# EAGLE design DAC_OutputStage_4 (EAGLE 9.6.2)
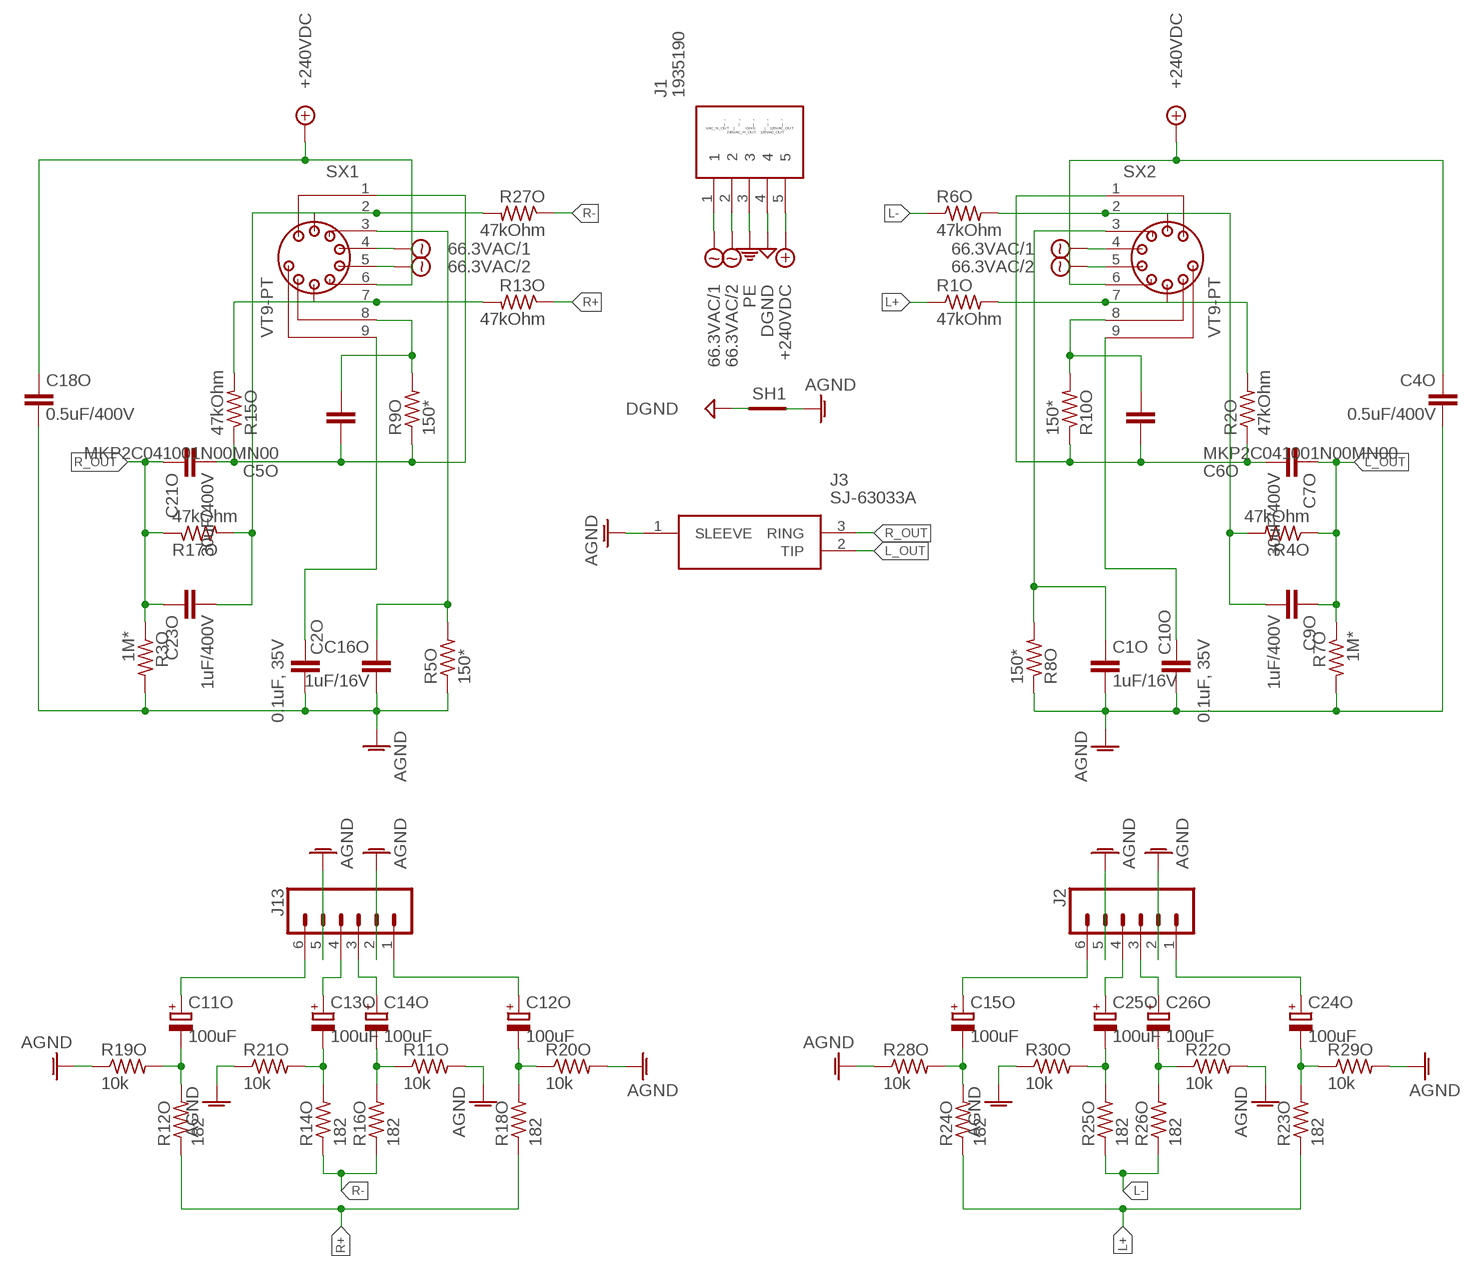
[diagram p0: schematic, sheet 1]

## Parts
C1O  1uF/16V  MKP2C041001N00MN00  [MKP2C041001N00MN00]
C2O  0.1uF, 35V  MKS4B031002A00JC00  [MKS4B031002A00JC00]
C4O  0.5uF/400V  MKP4G034705D00KSSD  [MKP4G034705D00KSSD]
C5O  MKP2C041001N00MN00  [MKP2C041001N00MN00]
C6O  MKP2C041001N00MN00  [MKP2C041001N00MN00]
C7O  30uF/400V  DCP4G053006ID2KSSD  [DCP4G053006ID2KSSD]
C9O  1uF/400V  MKP4G041005I00JSSD  [MKP4G041005I00JSSD]
C10O  0.1uF, 35V  MKS4B031002A00JC00  [MKS4B031002A00JC00]
C11O  100uF  UFW1H101MPD1TD  [CAPPRD350W60D825H1300]
C12O  100uF  UFW1H101MPD1TD  [CAPPRD350W60D825H1300]
C13O  100uF  UFW1H101MPD1TD  [CAPPRD350W60D825H1300]
C14O  100uF  UFW1H101MPD1TD  [CAPPRD350W60D825H1300]
C15O  100uF  UFW1H101MPD1TD  [CAPPRD350W60D825H1300]
C16O  1uF/16V  MKP2C041001N00MN00  [MKP2C041001N00MN00]
C18O  0.5uF/400V  MKP4G034705D00KSSD  [MKP4G034705D00KSSD]
C21O  30uF/400V  DCP4G053006ID2KSSD  [DCP4G053006ID2KSSD]
C23O  1uF/400V  MKP4G041005I00JSSD  [MKP4G041005I00JSSD]
C24O  100uF  UFW1H101MPD1TD  [CAPPRD350W60D825H1300]
C25O  100uF  UFW1H101MPD1TD  [CAPPRD350W60D825H1300]
C26O  100uF  UFW1H101MPD1TD  [CAPPRD350W60D825H1300]
J1  1935190  [1935190]
J2  CONN_06SILK_FEMALE_PTH  [1X06]
J3  SJ-63033A  [SJ63033A]
J13  CONN_06SILK_FEMALE_PTH  [1X06]
R1O  47kOhm  LR1F47K  [RESAD1540W55L620D230]
R2O  47kOhm  LR1F47K  [RESAD1540W55L620D230]
R3O  1M*  LR1F1M0  [RESAD1540W60L620D230]
R4O  47kOhm  LR1F47K  [RESAD1540W55L620D230]
R5O  150*  LR1F150R  [RESAD1540W55L620D230]
R6O  47kOhm  LR1F47K  [RESAD1540W55L620D230]
R7O  1M*  LR1F1M0  [RESAD1540W60L620D230]
R8O  150*  LR1F150R  [RESAD1540W55L620D230]
R9O  150*  LR1F150R  [RESAD1540W55L620D230]
R10O  150*  LR1F150R  [RESAD1540W55L620D230]
R11O  10k  LR1F10K  [RESAD1540W55L620D230]
R12O  182  MF0207FTE52-182R  [RESAD1590W60L630D240]
R13O  47kOhm  LR1F47K  [RESAD1540W55L620D230]
R14O  182  MF0207FTE52-182R  [RESAD1590W60L630D240]
R15O  47kOhm  LR1F47K  [RESAD1540W55L620D230]
R16O  182  MF0207FTE52-182R  [RESAD1590W60L630D240]
R17O  47kOhm  LR1F47K  [RESAD1540W55L620D230]
R18O  182  MF0207FTE52-182R  [RESAD1590W60L630D240]
R19O  10k  LR1F10K  [RESAD1540W55L620D230]
R20O  10k  LR1F10K  [RESAD1540W55L620D230]
R21O  10k  LR1F10K  [RESAD1540W55L620D230]
R22O  10k  LR1F10K  [RESAD1540W55L620D230]
R23O  182  MF0207FTE52-182R  [RESAD1590W60L630D240]
R24O  182  MF0207FTE52-182R  [RESAD1590W60L630D240]
R25O  182  MF0207FTE52-182R  [RESAD1590W60L630D240]
R26O  182  MF0207FTE52-182R  [RESAD1590W60L630D240]
R27O  47kOhm  LR1F47K  [RESAD1540W55L620D230]
R28O  10k  LR1F10K  [RESAD1540W55L620D230]
R29O  10k  LR1F10K  [RESAD1540W55L620D230]
R30O  10k  LR1F10K  [RESAD1540W55L620D230]
SH1  SHORTA5  [SHORT_ALL-50]
SX1  VT9-PT  [VT9-PT]
SX2  VT9-PT  [VT9-PT]

## Nets
66.3VAC/1: J1.1 SX1.4 SX2.4
66.3VAC/2: J1.2 SX1.5 SX2.5
+240VDC: C4O.1 C18O.1 J1.5 SX1.6 SX2.6
AGND: C1O.2 C2O.2 C4O.2 C10O.2 C16O.2 C18O.2 J2.2 J2.5 J3.1(SLEEVE) J13.2 J13.5 R3O.2 R5O.1 R7O.2 R8O.1 R11O.2 R19O.1 R20O.2 R21O.1 R22O.2 R28O.1 R29O.2 R30O.1 SH1.2
DGND: J1.4 SH1.1
L+: R1O.1 R23O.1 R24O.1
L-: R6O.1 R25O.1 R26O.1
L_OUT: C7O.1 C9O.1 J3.2(TIP) R4O.1 R7O.1
N$1: C5O.2 R9O.2 SX1.8
N$2: C2O.1 SX1.9
N$3: R1O.2 R2O.2 SX2.7
N$4: C6O.2 R10O.2 SX2.8
N$5: C6O.1 C7O.2 R2O.1 R10O.1 SX2.1
N$7: C9O.2 R4O.2 R6O.2 SX2.2
N$8: C1O.1 R8O.2 SX2.3
N$9: C10O.1 SX2.9
N$10: C11O.1(+) J13.6
N$11: C11O.2(-) R12O.2 R19O.2
N$12: C15O.1(+) J2.6
N$15: C12O.1(+) J13.1
N$16: R13O.2 R15O.2 SX1.7
N$18: C5O.1 C21O.2 R9O.1 R15O.1 SX1.1
N$19: C12O.2(-) R18O.2 R20O.1
N$20: C15O.2(-) R24O.2 R28O.2
N$21: C13O.1(+) J13.4
N$23: C23O.2 R17O.2 R27O.2 SX1.2
N$24: C14O.1(+) J13.3
N$25: C14O.2(-) R11O.1 R16O.2
N$26: C16O.1 R5O.2 SX1.3
N$28: C13O.2(-) R14O.2 R21O.2
N$30: C24O.1(+) J2.1
N$31: C24O.2(-) R23O.2 R29O.1
N$32: C25O.1(+) J2.4
N$33: C26O.1(+) J2.3
N$34: C26O.2(-) R22O.1 R26O.2
N$36: C25O.2(-) R25O.2 R30O.2
PE: J1.3
R+: R12O.1 R13O.1 R18O.1
R-: R14O.1 R16O.1 R27O.1
R_OUT: C21O.1 C23O.1 J3.3(RING) R3O.1 R17O.1

## Notes on the sheet
- ^             ^            ^            ^            ^
          |             |             |             |             |
  VAC_N_OUT    |           GND         |    126VAC_OUT
              240VAC_H_OUT    126VAC_OUT

## Library data of the parts
C1O C5O C6O C16O = Dual Mono Amp Library:MKP2C041001N00MN00: Film Capacitors MKP 2 1.0 uF 63 VDC 11x16x7.2 PCM 5 Source: Datasheet; DESCRIPTION: Film Capacitors MKP 2 1.0 uF 63 VDC 11x16x7.2 PCM 5; HEIGHT: 16mm; MANUFACTURER_NAME: WIMA; MANUFACTURER_PART_NUMBER: MKP2C041001N00MN00; MOUSER_PART_NUMBER: 505-MKP2C0411NMN; MOUSER_PRICE-STOCK: https://www.mouser.co.uk/ProductDetail/WIMA/MKP2C041001N00MN00?qs=RB4whv9F6rzjnMhXY4f0hA%3D%3D
C2O C10O = Dual Mono Amp Library:MKS4B031002A00JC00: Film Capacitors MKS 4 0.1 uF 50 VDC 2.5x7x10 PCM 7.5 Source: Datasheet <https://www.wima.de/wp-content/uploads/media/e_WIMA_MKS_4.pdf>; DESCRIPTION: Film Capacitors MKS 4 0.1 uF 50 VDC 2.5x7x10 PCM 7.5; HEIGHT: 7mm; MANUFACTURER_NAME: WIMA; MANUFACTURER_PART_NUMBER: MKS4B031002A00JC00; MOUSER_PART_NUMBER: 505-MKS4B0312AJC; MOUSER_PRICE-STOCK: https://www.mouser.co.uk/ProductDetail/WIMA/MKS4B031002A00JC00?qs=2G4irm%2FqADy9MV8AUfKNYA%3D%3D
C4O C18O = Dual Mono Amp Library:MKP4G034705D00KSSD: 0.47 F Film Capacitor 220V 400V Polypropylene (PP), Metallized Radial Source: Datasheet <https://www.wima.de/wp-content/uploads/media/e_WIMA_MKP_4.pdf>; DESCRIPTION: 0.47 F Film Capacitor 220V 400V Polypropylene (PP), Metallized Radial; HEIGHT: 16.5mm; MANUFACTURER_NAME: WIMA; MANUFACTURER_PART_NUMBER: MKP4G034705D00KSSD; MOUSER_PART_NUMBER: 505-MKP4G034705DKSSD; MOUSER_PRICE-STOCK: http://www.mouser.com/Search/ProductDetail.aspx?qs=sJjjjplDs9uaOctv9bTMfA%3d%3d
C7O C21O = Dual Mono Amp Library:DCP4G053006ID2KSSD: Film Capacitors DC-LINK MKP 4 30.0 uF 400 VDC 17x34.5x31.5 PCM 27.5 Source: Datasheet <https://www.wima.de/wp-content/uploads/media/e_WIMA_DC_Link_MKP_4.pdf>; DESCRIPTION: Film Capacitors DC-LINK MKP 4 30.0 uF 400 VDC 17x34.5x31.5 PCM 27.5; HEIGHT: 34.5mm; MANUFACTURER_NAME: WIMA; MANUFACTURER_PART_NUMBER: DCP4G053006ID2KSSD; MOUSER_PART_NUMBER: 505-DCP4G0536ID2KSSD; MOUSER_PRICE-STOCK: https://www.mouser.co.uk/ProductDetail/WIMA/DCP4G053006ID2KSSD?qs=RB4whv9F6rwxZ2Ey0tRejg%3D%3D
C9O C23O = Dual Mono Amp Library:MKP4G041005I00JSSD: Film Capacitors 1uF 400 Volts 5% Source: Datasheet <https://www.wima.de/wp-content/uploads/media/e_WIMA_MKP_4.pdf>; DESCRIPTION: Film Capacitors 1uF 400 Volts 5%; HEIGHT: 21mm; MANUFACTURER_NAME: WIMA; MANUFACTURER_PART_NUMBER: MKP4G041005I00JSSD; MOUSER_PART_NUMBER: 505-MKP4G041005I00JS; MOUSER_PRICE-STOCK: https://www.mouser.co.uk/ProductDetail/WIMA/MKP4G041005I00JSSD?qs=JZ%252BiKJYxjZXJVyWNRtSklQ%3D%3D
C11O C12O C13O C14O C15O C24O C25O C26O = Dual Mono Amp Library:UFW1H101MPD1TD: Aluminum Electrolytic Capacitors - Radial Leaded 100uF 50 Volts 20% Source: Datasheet <https://www.nichicon.co.jp/english/series_items/catalog_pdf/e-ufw.pdf>; ARROW_PART_NUMBER: UFW1H101MPD1TD; ARROW_PRICE-STOCK: https://www.arrow.com/en/products/ufw1h101mpd1td/nichicon; DESCRIPTION: Aluminum Electrolytic Capacitors - Radial Leaded 100uF 50 Volts 20%; HEIGHT: 13mm; MANUFACTURER_NAME: Nichicon; MANUFACTURER_PART_NUMBER: UFW1H101MPD1TD; MOUSER_PART_NUMBER: 647-UFW1H101MPD1TD; MOUSER_PRICE-STOCK: https://www.mouser.co.uk/ProductDetail/Nichicon/UFW1H101MPD1TD?qs=WJSLByB5Mu30jPPJ2KiG3A%3D%3D
J1 = Dual Mono Amp Library:1935190: PCB terminal block, nominal current: 17.5 A, rated voltage (III/2): 400 V, nominal cross section: 1.5 mm?, Number of potentials: 5, Number of rows: 1, Number of positions per row: 5, product range: PT 1,5/..-H, pitch: 5 mm, connection method: Screw connection with wire protector, mounting: Wave soldering, conductor/PCB connection direction: 0 ?, color: green, Pin layout: Linear pinning, Solder pin [P]: 3.5 mm, type of packaging: packed in cardboard Source: Datasheet <https://www.phoenixcontact.com/online/portal/us/pxc/product_detail_page/!ut/p/z1/3Vdbc5pAFP4r5sG3rLsLLEJn-oDGlJjEYsQqvDDssma24RZETf31Xbyk1Wn1IeN0CnNm2D2c853L8jEc6MMp9NNwKZ7DUmRpGMu95-uB23F7PUfR8dch6aC7G9LtPWhP2B4o8Bv0oV-GFHq4WsWCFmHxA3qLOU8rRS4i-chUCTZRtc>; DESCRIPTION: PCB terminal block, nominal current: 17.5 A, rated voltage (III/2): 400 V, nominal cross section: 1.5 mm?, Number of potentials: 5, Number of rows: 1, Number of positions per row: 5, product range: PT 1,5/..-H, pitch: 5 mm, connection method: Screw connection with wire protector, mounting: Wave soldering, conductor/PCB connection direction: 0 ?, color: green, Pin layout: Linear pinning, Solder pin [P]: 3.5 mm, type of packaging: packed in cardboard; HEIGHT: 11.55mm; MANUFACTURER_NAME: Phoenix Contact; MANUFACTURER_PART_NUMBER: 1935190; MOUSER_PART_NUMBER: 651-1935190; MOUSER_PRICE-STOCK: https://www.mouser.co.uk/ProductDetail/Phoenix-Contact/1935190?qs=QWULklcAmSS%2FS46GSzyZOw%3D%3D
J2 J13 = Dual Mono Amp Library:CONN_06: Multi connection point. Often used as Generic Header-pin footprint for 0.1 inch spaced/style header connections On any of the 0.1 inch spaced packages, you can populate with these: Break Away Headers - Straight <https://www.sparkfun.com/products/116> (PRT-00116) Break Away Male Headers - Right Angle <https://www.sparkfun.com/products/553> (PRT-00553) Female Headers <https://www.sparkfun.com/products/115> (PRT-00115) Break Away Headers - Machine Pin <https://www.sparkfun.com/products/117> (PRT-00117) Break Away Female Headers - Swiss Machine Pin <https://www.sparkfun.com/products/743> (PRT-00743) Arduino Stackable Header - 6 Pin <https://www.sparkfun.com/products/9280> (PRT-09280) Screw Terminals 2.54mm Pitch (6-Pin) <https://www.sparkfun.com/products/16499> (PRT-16499) For SCREWTERMINALS and SPRING TERMINALS visit here: Screw Terimnals on SparkFun.com <https://www.sparkfun.com/search/results?term=Screw+Terminals> (5mm/3.5mm/2.54mm spacing) This device is also useful as a general connection point to wire up your design to another part of your project. Our various solder wires solder well into these plated through hole pads. Hook-Up Wire - Assortment (Stranded, 22 AWG) <https://www.sparkfun.com/products/11375> (PRT-11375) Hook-Up Wire - Assortment (Solid Core, 22 AWG) <https://www.sparkfun.com/products/11367> (PRT-11367) View the entire wire category on our website here <https://www.sparkfun.com/categories/141>; PROD_ID: CONN-08437
J3 = Dual Mono Amp Library:SJ-63033A: 6.35 mm, Stereo, Right Angle, Through Hole Mount, 3 Conductors, 0 Internal Switches, Audio Jack Connector Source: Datasheet <https://www.cuidevices.com/product/resource/sj-63033a.pdf>; DESCRIPTION: 6.35 mm, Stereo, Right Angle, Through Hole Mount, 3 Conductors, 0 Internal Switches, Audio Jack Connector; HEIGHT: 12.3mm; MANUFACTURER_NAME: CUI Devices; MANUFACTURER_PART_NUMBER: SJ-63033A
R1O R2O R4O R6O R13O R15O R17O R27O = Dual Mono Amp Library:LR1F47K: TE Connectivity LR1F Series Axial Metal Film Resistor 47k +/-1% 0.6W +/-50ppm/C Source: Datasheet <https://componentsearchengine.com/Datasheets/2/LR1F47K.pdf>; DESCRIPTION: TE Connectivity LR1F Series Axial Metal Film Resistor 47k +/-1% 0.6W +/-50ppm/C; HEIGHT: mm; MANUFACTURER_NAME: TE Connectivity; MANUFACTURER_PART_NUMBER: LR1F47K; MOUSER_PART_NUMBER: 279-LR1F47K; MOUSER_PRICE-STOCK: https://www.mouser.co.uk/ProductDetail/TE-Connectivity-Holsworthy/LR1F47K?qs=ip69W3eHERWQ8q3y81tH5w%3D%3D
R3O R7O = Dual Mono Amp Library:LR1F1M0: TE Connectivity Axial Metal Film Resistor 1m +/-1% 0.6W +/-50ppm/C Source: Datasheet <https://www.te.com/commerce/DocumentDelivery/DDEController?Action=showdoc&DocId=Data Sheet1773241GpdfEnglishENG_DS_1773241_G.pdf1622367-1>; DESCRIPTION: TE Connectivity Axial Metal Film Resistor 1m +/-1% 0.6W +/-50ppm/C; HEIGHT: mm; MANUFACTURER_NAME: TE Connectivity; MANUFACTURER_PART_NUMBER: LR1F1M0; MOUSER_PART_NUMBER: 279-LR1F1M0; MOUSER_PRICE-STOCK: https://www.mouser.co.uk/ProductDetail/TE-Connectivity-Holsworthy/LR1F1M0?qs=ip69W3eHERVt%2FmQVAugcSg%3D%3D
R5O R8O R9O R10O = Dual Mono Amp Library:LR1F150R: TE Connectivity LR1F Series Axial Metal Film Resistor 150 +/-1% 0.6W +/-50ppm/C Source: Datasheet <https://datasheet.datasheetarchive.com/originals/distributors/DKDS-21/401716.pdf>; DESCRIPTION: TE Connectivity LR1F Series Axial Metal Film Resistor 150 +/-1% 0.6W +/-50ppm/C; HEIGHT: mm; MANUFACTURER_NAME: TE Connectivity; MANUFACTURER_PART_NUMBER: LR1F150R
R11O R19O R20O R21O R22O R28O R29O R30O = Dual Mono Amp Library:LR1F10K: Metal film resistor, 10K 0.6W TE Connectivity LR1F Series Axial Metal Film Resistor 10k Source: Datasheet <https://datasheet.datasheetarchive.com/originals/distributors/DKDS-21/401716.pdf>; DESCRIPTION: Metal film resistor, 10K 0.6W TE Connectivity LR1F Series Axial Metal Film Resistor 10k; HEIGHT: mm; MANUFACTURER_NAME: TE Connectivity; MANUFACTURER_PART_NUMBER: LR1F10K; MOUSER_PART_NUMBER: 279-LR1F10K; MOUSER_PRICE-STOCK: https://www.mouser.co.uk/ProductDetail/TE-Connectivity-Holsworthy/LR1F10K?qs=ip69W3eHERWDLLWs2Qv0Lg%3D%3D
R12O R14O R16O R18O R23O R24O R25O R26O = Dual Mono Amp Library:MF0207FTE52-182R: Metal Film Resistors - Through Hole 0.6W 1% 182 ohm 50pp m Source: Datasheet <https://www.mouser.com/datasheet/2/447/YAGEO_MF0_datasheet_2021v1-3003020.pdf>; DESCRIPTION: Metal Film Resistors - Through Hole 0.6W 1% 182 ohm 50pp m; HEIGHT: mm; MANUFACTURER_NAME: YAGEO; MANUFACTURER_PART_NUMBER: MF0207FTE52-182R
SH1 = Dual Mono Amp Library:SHORT: Short between two nets; BOM: No; DESCRIPTION: Short between two nets
SX1 SX2 = Dual Mono Amp Library:VT9: VACUUM TUBE SOCKET Source: 00004280-VT9-PT.pdf

## Board
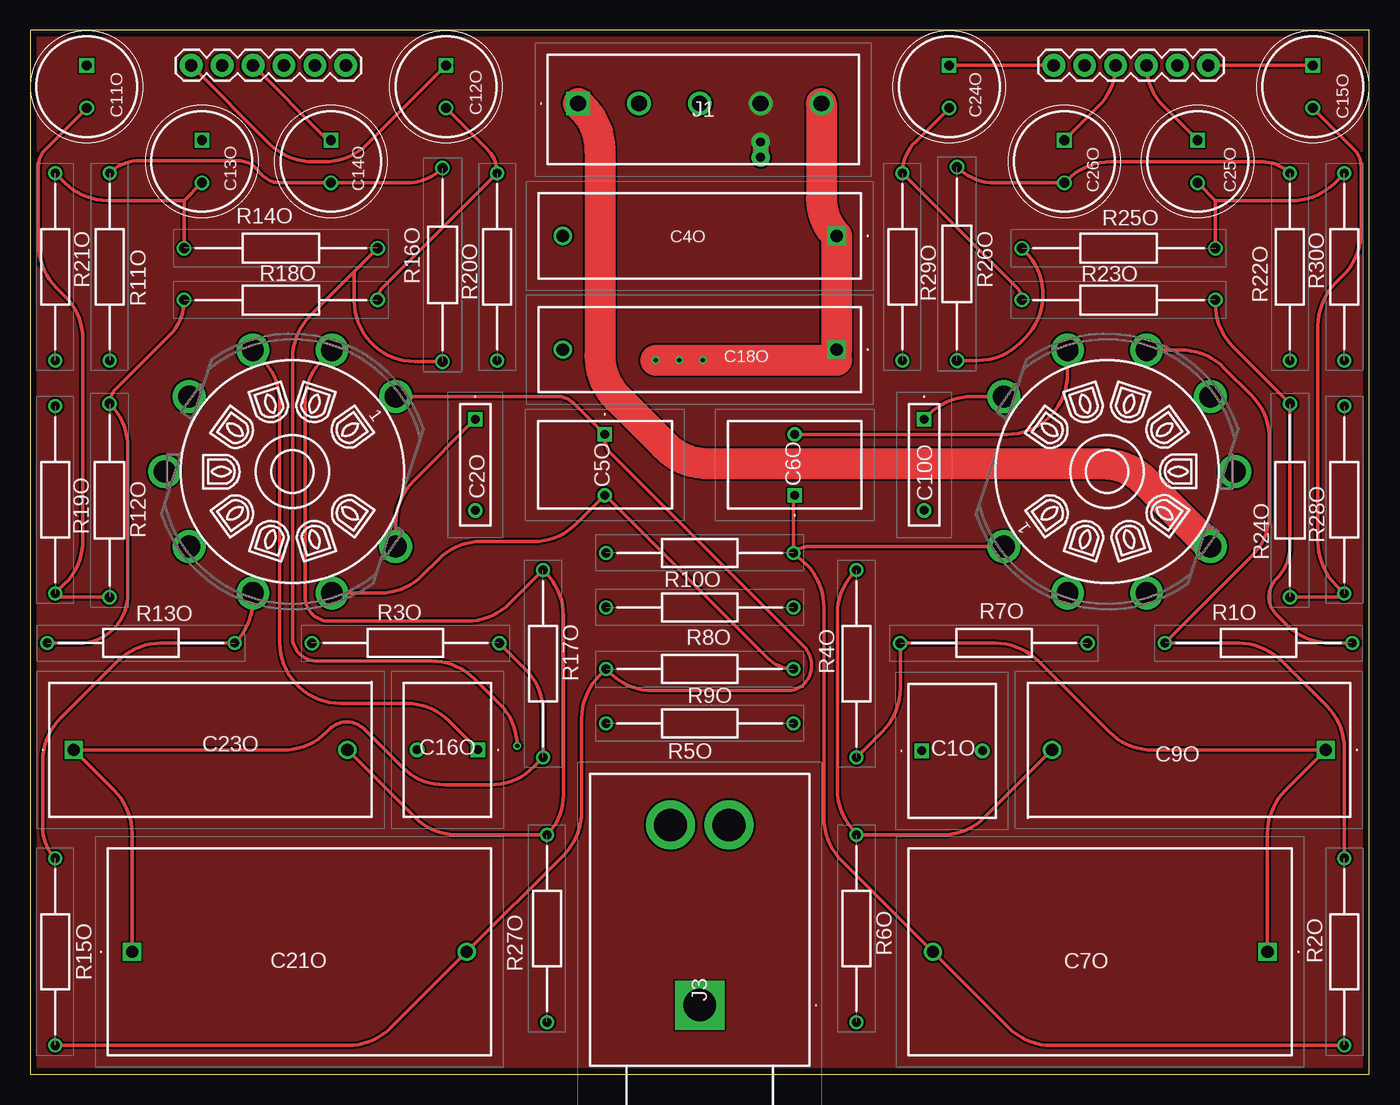
[diagram p1: board, top side]
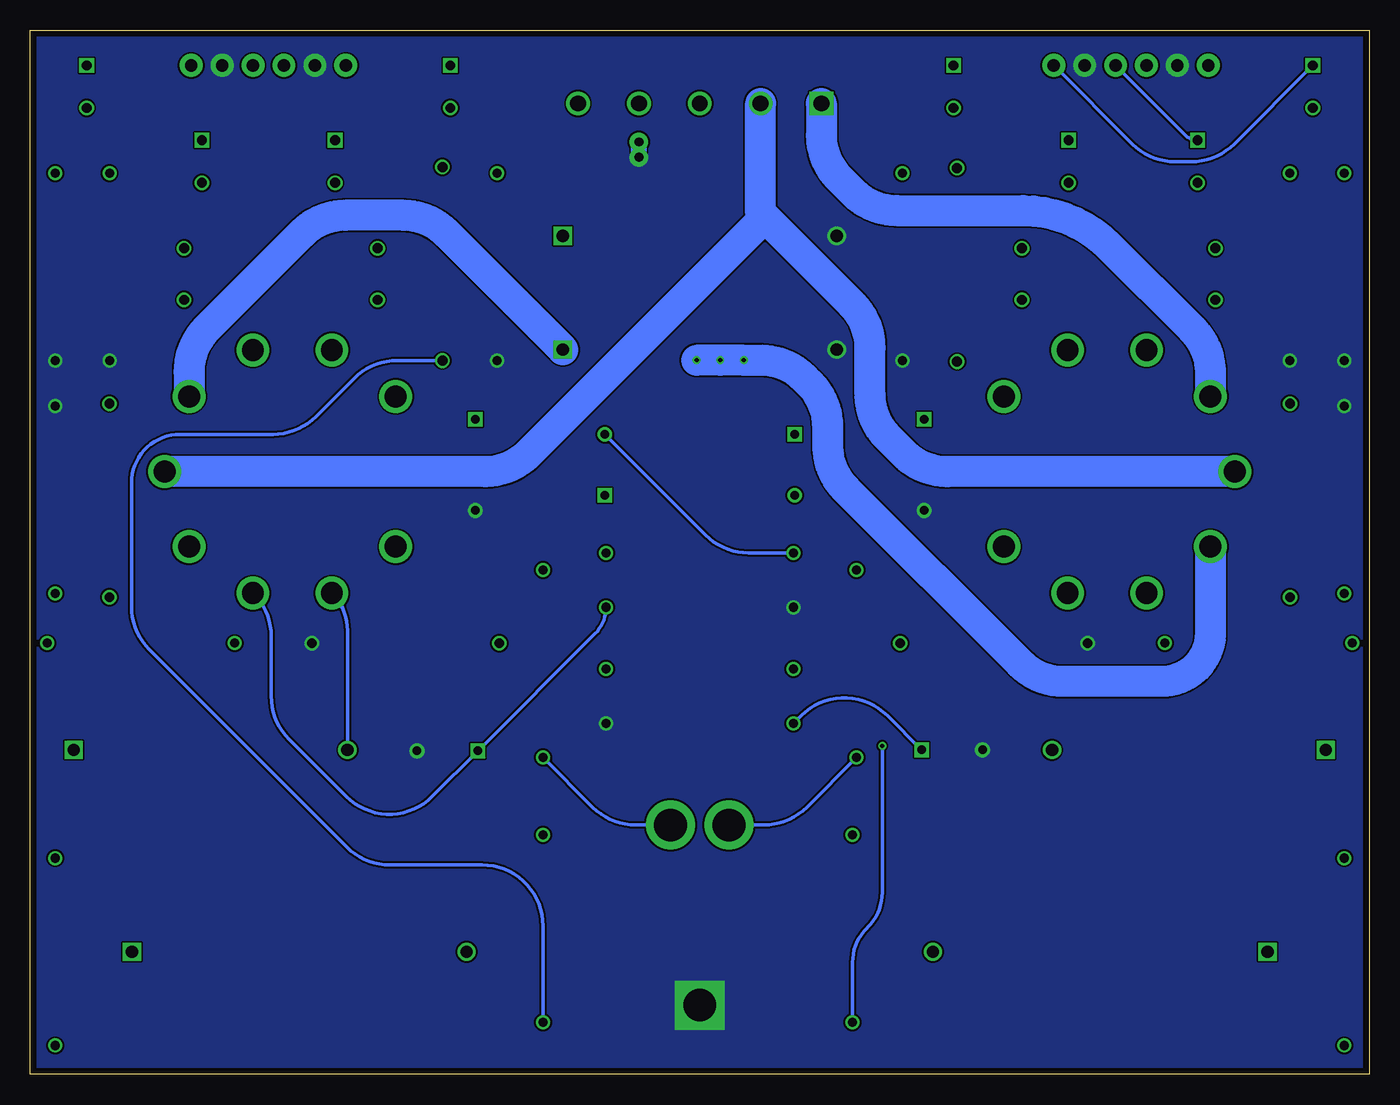
[diagram p2: board, bottom side, seen from below]

Size 110 x 85.8 mm. Coordinates in mm from the lower left corner, seen from the top.
Outline: 0,0 110,0 110,85.8 0,85.8 0,0
Copper layers (1*16): Top 0.035mm / dielectric 1.6mm / Bottom 0.035mm
Design rules "Elecrow_2-layer_PCB_eagle_rule": minimum track width 6mil, minimum drill 12mil, track to track 6mil, track to pad 6mil, pad to pad 6mil, via to via 8mil, smd to smd 0mil, copper to edge 20mil, drill to drill 10mil, minimum pad ring 6mil, minimum via ring 6mil, stop-mask expansion 0mil, vias tented up to drill 100mil, thermal gap 10mil

### Footprints (pad centres in the part's own frame; a part is rotated, then mirrored left to right if it is on the bottom)
MKP2C041001N00MN00 = drill 0.7 pad 1.2 square: 1 0,0 | drill 0.7 pad 1.2: 2 5,0
MKS4B031002A00JC00 = drill 0.7 pad 1.2 square: 1 0,0 | drill 0.7 pad 1.2: 2 7.5,0
MKP4G034705D00KSSD = drill 1 pad 1.5 square: 1 0,0 | drill 1 pad 1.5: 2 22.5,0
DCP4G053006ID2KSSD = drill 1 pad 1.5 square: 1 0,0 | drill 1 pad 1.5: 2 27.5,0
MKP4G041005I00JSSD = drill 1 pad 1.5 square: 1 0,0 | drill 1 pad 1.5: 2 22.5,0
CAPPRD350W60D825H1300 = drill 0.8 pad 1.2 square: 1 0,0 | drill 0.8 pad 1.2: 2 3.5,0
1935190 = drill 1.3 pad 1.95 square: 1 0,0 | drill 1.3 pad 1.95: 2 5,0; 3 10,0; 4 15,0; 5 20,0
1X06 = drill 1.016 pad 1.88: 1 0,0; 2 2.54,0; 3 5.08,0; 4 7.62,0; 5 10.16,0; 6 12.7,0
SJ63033A = drill 2.69 pad 4.035 square: 1 0,0 | drill 2.69 pad 4.035: 2 14.8,-2.4; 3 14.8,2.4
RESAD1540W55L620D230 = drill 0.75 pad 1.15: 1 0,0; 2 15.4,0
RESAD1540W60L620D230 = drill 0.8 pad 1.2: 1 0,0; 2 15.4,0
RESAD1590W60L630D240 = drill 0.8 pad 1.2: 1 0,0; 2 15.9,0
SHORT_ALL-50 = drill 0.737 pad 1.524: 1 -0.635,0; 2 0.635,0
VT9-PT = drill 1.8 pad 2.4: 1 6.172,8.495; 2 0,10.5; 3 -6.172,8.495; 4 -9.986,3.245; 5 -9.986,-3.245; 6 -6.172,-8.495; 7 0,-10.5; 8 6.172,-8.495; 9 9.986,-3.244

### Placement (x,y rotation side)
C1O  73.23,26.59 0 top
C2O  36.55,53.85 270 top
C4O  66.25,68.92 180 top
C5O  47.2,52.6 270 top
C6O  62.8,47.6 90 top
C7O  101.65,10.08 180 top
C9O  106.45,26.67 180 top
C10O  73.45,53.85 270 top
C11O  4.62,82.92 270 top
C12O  34.15,82.92 270 top
C13O  14.08,76.78 270 top
C14O  24.69,76.78 270 top
C15O  105.38,82.92 270 top
C16O  36.77,26.67 180 top
C18O  66.25,59.57 180 top
C21O  8.35,10.08 0 top
C23O  3.55,26.67 0 top
C24O  75.5,82.92 270 top
C25O  95.92,76.78 270 top
C26O  84.96,76.78 270 top
J1  45,79.8 0 top
J2  84.09,82.92 0 top
J3  55,5.7 90 top
J13  13.21,82.92 0 top
R1O  108.62,35.45 180 top
R2O  107.97,2.38 90 top
R3O  38.52,35.45 180 top
R4O  67.88,26.05 90 top
R5O  62.7,28.85 180 top
R6O  67.88,4.29 90 top
R7O  71.47,35.45 0 top
R8O  47.3,38.39 0 top
R9O  47.3,33.32 0 top
R10O  62.7,42.86 180 top
R11O  6.5,74.07 270 top
R12O  6.5,55.13 270 top
R13O  1.38,35.45 0 top
R14O  28.53,67.9 180 top
R15O  2.03,2.38 90 top
R16O  33.86,58.59 90 top
R17O  42.12,26.05 90 top
R18O  12.63,63.65 0 top
R19O  2.03,54.93 270 top
R20O  38.35,74.07 270 top
R21O  2.03,58.67 90 top
R22O  103.5,74.07 270 top
R23O  97.37,63.65 180 top
R24O  103.5,55.13 270 top
R25O  81.47,67.9 0 top
R26O  76.14,58.67 90 top
R27O  42.45,4.29 90 top
R28O  107.97,54.93 270 top
R29O  71.65,74.07 270 top
R30O  107.97,58.67 90 top
SH1  60,76 270 top
SX1  21.53,49.55 342 top
SX2  88.47,49.55 162 top

### Tracks (layer width: path | path; a pad name or v marks a point on that pad's centre or on a via)
66.3VAC/1
  Top 2.54: J1.1 45.34,79.46 arc-45 46.8,75.93 46.8,59.07 arc45 48.26,55.54 52.14,51.66 arc45 55.67,50.2 88.07,50.2 arc-45 91.61,48.74 SX2.4
  Bottom 2.54: J1.1 45,77.17 arc-45 43.54,73.64 42.36,72.46 arc-45 38.83,71 28.44,71 arc45 21.37,68.07 14.5,61.2 arc45 13.03,57.66 SX1.4
66.3VAC/2
  Bottom 2.54: SX1.5 34.68,49.55 arc45 38.21,51.01 39.54,52.34 arc45 41,55.87 41,59.73 arc-45 42.46,63.26 49.65,70.45 | 49.65,70.45 50,70.8 J1.2 | 49.65,70.45 69.09,51.01 arc45 72.62,49.55 SX2.5
+240VDC  (via drill 0.35)
  Top 2.54: J1.5 65,71.94 arc45 C4O.1 C18O.1 66.25,58.7 56,58.7 v53.32,58.7 v51.38,58.7
  Bottom 2.54: SX1.6 13.03,36.3 arc90 17.03,32.3 25.13,32.3 arc45 28.66,33.76 43.01,48.11 arc45 44.48,51.65 44.48,53.22 arc-45 45.94,56.75 46.42,57.24 arc-45 49.96,58.7 v51.38,58.7 v53.32,58.7 v55.25,58.7 | C18O.1 75.82,69.14 arc-45 79.35,70.6 84.13,70.6 arc-45 87.66,69.14 95.5,61.3 arc-45 96.97,57.76 SX2.6
AGND
  pour Bottom (rank 6, no thermals): 0.15,0.15 109.85,0.15 109.85,85.65 0.15,85.65
DGND
  pour Top (rank 6, no thermals): 0.15,0.15 109.85,0.15 109.85,85.65 0.15,85.65
L+
  Top 0.305: R23O.1 97.37,63.33 arc45 98.83,59.8 R24O.1 103.5,43.46 arc-45 102.35,40.68 arc90 102.35,37.85 103.29,36.91 arc45 106.82,35.45 R1O.1
L-
  Top 0.305: R26O.1 77.8,58.67 arc45 81.33,60.13 81.75,60.55 arc90 81.75,67.62 R25O.1
  Bottom 0.305: R6O.1 67.88,12.22 arc-90 72.88,17.22 80.46,17.22 arc45 83.99,18.68 100.23,34.92 arc45 101.7,38.46 101.7,48.6 arc90 97.7,52.6 90.07,52.6 arc-45 86.54,54.07 83.4,57.21 arc45 79.86,58.67 R26O.1
L_OUT
  Top 0.305: C7O.1 101.65,19.8 arc-45 103.11,23.34 C9O.1 92.2,26.67 arc-45 88.66,28.14 82.81,33.99 arc45 79.28,35.45 R7O.1 71.47,31.72 arc-45 70.01,28.18 R4O.1
  Bottom 0.305: J3.2 60.26,20.5 arc45 63.79,21.96 R4O.1
N$1
  Top 0.305: R9O.2 arc-45 60.62,34.18 C5O.2 44.86,45.26 arc-45 41.33,43.8 37.07,43.8 arc45 33.54,42.34 32.23,41.03 arc-45 28.69,39.56 SX1.8
N$2
  Top 0.305: SX1.9 30.02,45.25 arc-45 31.49,48.78 C2O.1
N$3
  Top 0.305: R2O.2 107.97,26.76 arc45 106.5,30.3 102.81,33.99 arc45 99.28,35.45 R1O.2 100.34,42.57 arc45 101.8,46.1 101.8,52.28 arc45 100.34,55.81 98.08,58.07 arc45 94.55,59.53 SX2.7
N$4
  Top 0.305: SX2.8 85.23,57.6 arc-90 80.23,52.6 C6O.2
  Bottom 0.305: R10O.2 50.99,42.86 arc45 54.53,44.33 C6O.2
N$5
  Top 0.305: R2O.1 83.92,2.38 arc-45 80.39,3.84 C7O.2 66.66,17.57 arc-45 65.2,21.1 65.2,38.41 arc49 63.49,42.17 R10O.1 | C6O.1 62.7,47.5 R10O.1 | R10O.1 arc-45 63.94,43.38 SX2.1
N$7
  Top 0.305: R6O.2 68,19.69 | 68,19.69 74.89,19.69 arc45 78.43,21.15 C9O.2 | R4O.2 67.76,41.34 arc45 66.3,37.8 66.3,23.46 arc45 67.76,19.93 68,19.69
  Bottom 0.305: C9O.2 83.95,36.48 arc-45 SX2.2
N$8
  Bottom 0.305: R8O.2 arc45 63.6,36.22 C1O.1 76.98,22.85 arc90 84.05,22.85 88.75,27.55 arc45 90.22,31.09 90.22,35.99 arc-45 91.68,39.53 SX2.3
N$9
  Top 0.305: C10O.1 73.85,54.26 arc-45 77.39,55.72 SX2.9
N$10
  Bottom 0.305: C11O.1 11.09,76.46 arc45 14.62,75 15.92,75 arc45 19.45,76.46 J13.6
N$11
  Top 0.305: R12O.2 2.33,39.23 R19O.2 2.84,40.34 arc45 4.3,43.87 4.3,60.43 arc45 2.84,63.96 2.12,64.67 arc-45 0.66,68.21 0.66,74.63 arc-45 1.25,76.05 C11O.2
N$12
  Top 0.305: J2.6 C15O.1
N$15
  Top 0.305: J13.1 19.67,76.46 arc45 23.21,75 24.15,75 arc45 27.69,76.46 C12O.1
N$16
  Top 0.305: R15O.2 arc-45 1,20.27 1,25.73 arc-45 2.46,29.26 7.19,33.99 arc-45 10.72,35.45 R13O.2 16.82,35.49 arc45 18.28,39.02 SX1.7
N$18
  Top 0.305: R15O.1 26.08,2.38 arc45 29.61,3.84 C21O.2 43.84,18.07 arc45 45.3,21.6 45.3,29.25 arc-45 46.76,32.78 R9O.1 47.62,33.01 arc45 51.15,31.54 62.18,31.54 arc90 64.18,33.54 64.18,33.71 arc45 63.59,35.13 47.79,50.94 arc-45 47.2,52.35 C5O.1 44.66,55.13 arc45 43.25,55.72 SX1.1
N$19
  Top 0.305: C12O.2 37.54,76.03 arc-45 R20O.1 28.95,64.67 arc45 R18O.2
N$20
  Top 0.305: R24O.2 107.25,39.23 arc45 R28O.2 107.26,40.23 arc-45 105.8,43.77 105.8,61.53 arc-45 107.26,65.06 107.88,65.67 arc45 109.34,69.21 109.34,74.63 arc45 108.75,76.05 C15O.2
N$21
  Bottom 0.305: C13O.1 arc45 15.12,77.21 J13.4
N$23
  Top 0.305: C23O.2 31.57,21.15 arc45 35.1,19.69 R27O.2 arc45 43.8,22.96 43.8,37.7 arc45 42.34,41.24 R17O.2 39.39,38.71 arc-45 35.85,37.25 24.57,37.25 arc-90 22.57,39.25 22.57,55.26 arc-45 24.04,58.8 SX1.2
N$24
  Top 0.305: J13.3 24.26,76.96 arc45 C14O.1
N$25
  Top 0.305: R16O.2 arc-45 30.94,73.28 C14O.2 20.52,73.28 arc-45 19.1,73.87 18.45,74.51 arc45 17.04,75.1 8.99,75.1 arc45 R11O.1
N$26
  Top 0.305: C16O.1 34.41,29.04 arc45 30.87,30.5 25.48,30.5 arc-90 20.48,35.5 20.48,55.26 arc45 19.02,58.8 SX1.3
  Bottom 0.305: C16O.1 39.59,29.49 arc-90 46.66,29.49 R5O.2
N$28
  Top 0.305: C13O.2 12.63,71.83 | 12.63,71.83 R14O.2 | R21O.2 2.81,73.29 arc45 6.34,71.83 12.63,71.83
N$30
  Top 0.305: J2.1 C24O.1
N$31
  Top 0.305: C24O.2 72.71,76.63 arc45 R29O.1 81.05,64.67 arc-45 R23O.2
N$32
  Top 0.305: J2.4 arc45 93.08,79.62 C25O.1
N$33
  Top 0.305: C26O.1 87.8,79.62 arc45 J2.3
N$34
  Top 0.305: R26O.2 arc45 79.25,73.28 C26O.2 85.21,73.54 arc-45 88.75,75 101.25,75 arc-45 R22O.1
N$36
  Top 0.305: C25O.2 97.37,71.83 97.37,71.8 | 97.37,71.8 R25O.2 | R30O.2 107.16,73.26 arc-45 103.63,71.8 97.37,71.8
R+
  Top 0.305: R18O.1 arc-45 11.44,60.77 7,56.33 arc45 R12O.1 6.54,55.09 arc-45 8,51.56 8,39.45 arc-90 4,35.45 R13O.1
R-  (via drill 0.35)
  Top 0.305: 26.6,65.97 R14O.1 | v40,27 arc45 38.59,30.41 36.49,32.51 arc45 32.95,33.98 23.53,33.98 arc-90 21.53,35.98 21.53,58.83 arc-45 22.99,62.36 26.6,65.97 | R16O.1 31.6,58.59 arc-90 26.6,63.59 26.6,65.97
  Bottom 0.305: R27O.1 42.45,9.2 arc45 41.27,12.03 41.17,12.13 arc-45 40,14.96 v40,27
R_OUT
  Top 0.305: C21O.1 8.35,19.8 arc45 6.89,23.34 C23O.1 20.8,26.67 arc45 24.34,28.14 24.59,28.39 arc-90 27.41,28.39 30.54,25.26 arc45 34.07,23.8 37.8,23.8 arc45 41.34,25.26 R17O.1 42.12,29.78 arc45 40.66,33.32 R3O.1
  Bottom 0.305: R17O.1 46.21,21.96 arc45 49.74,20.5 J3.3